# EAGLE design LME49600_HPA (EAGLE 7.2.0)
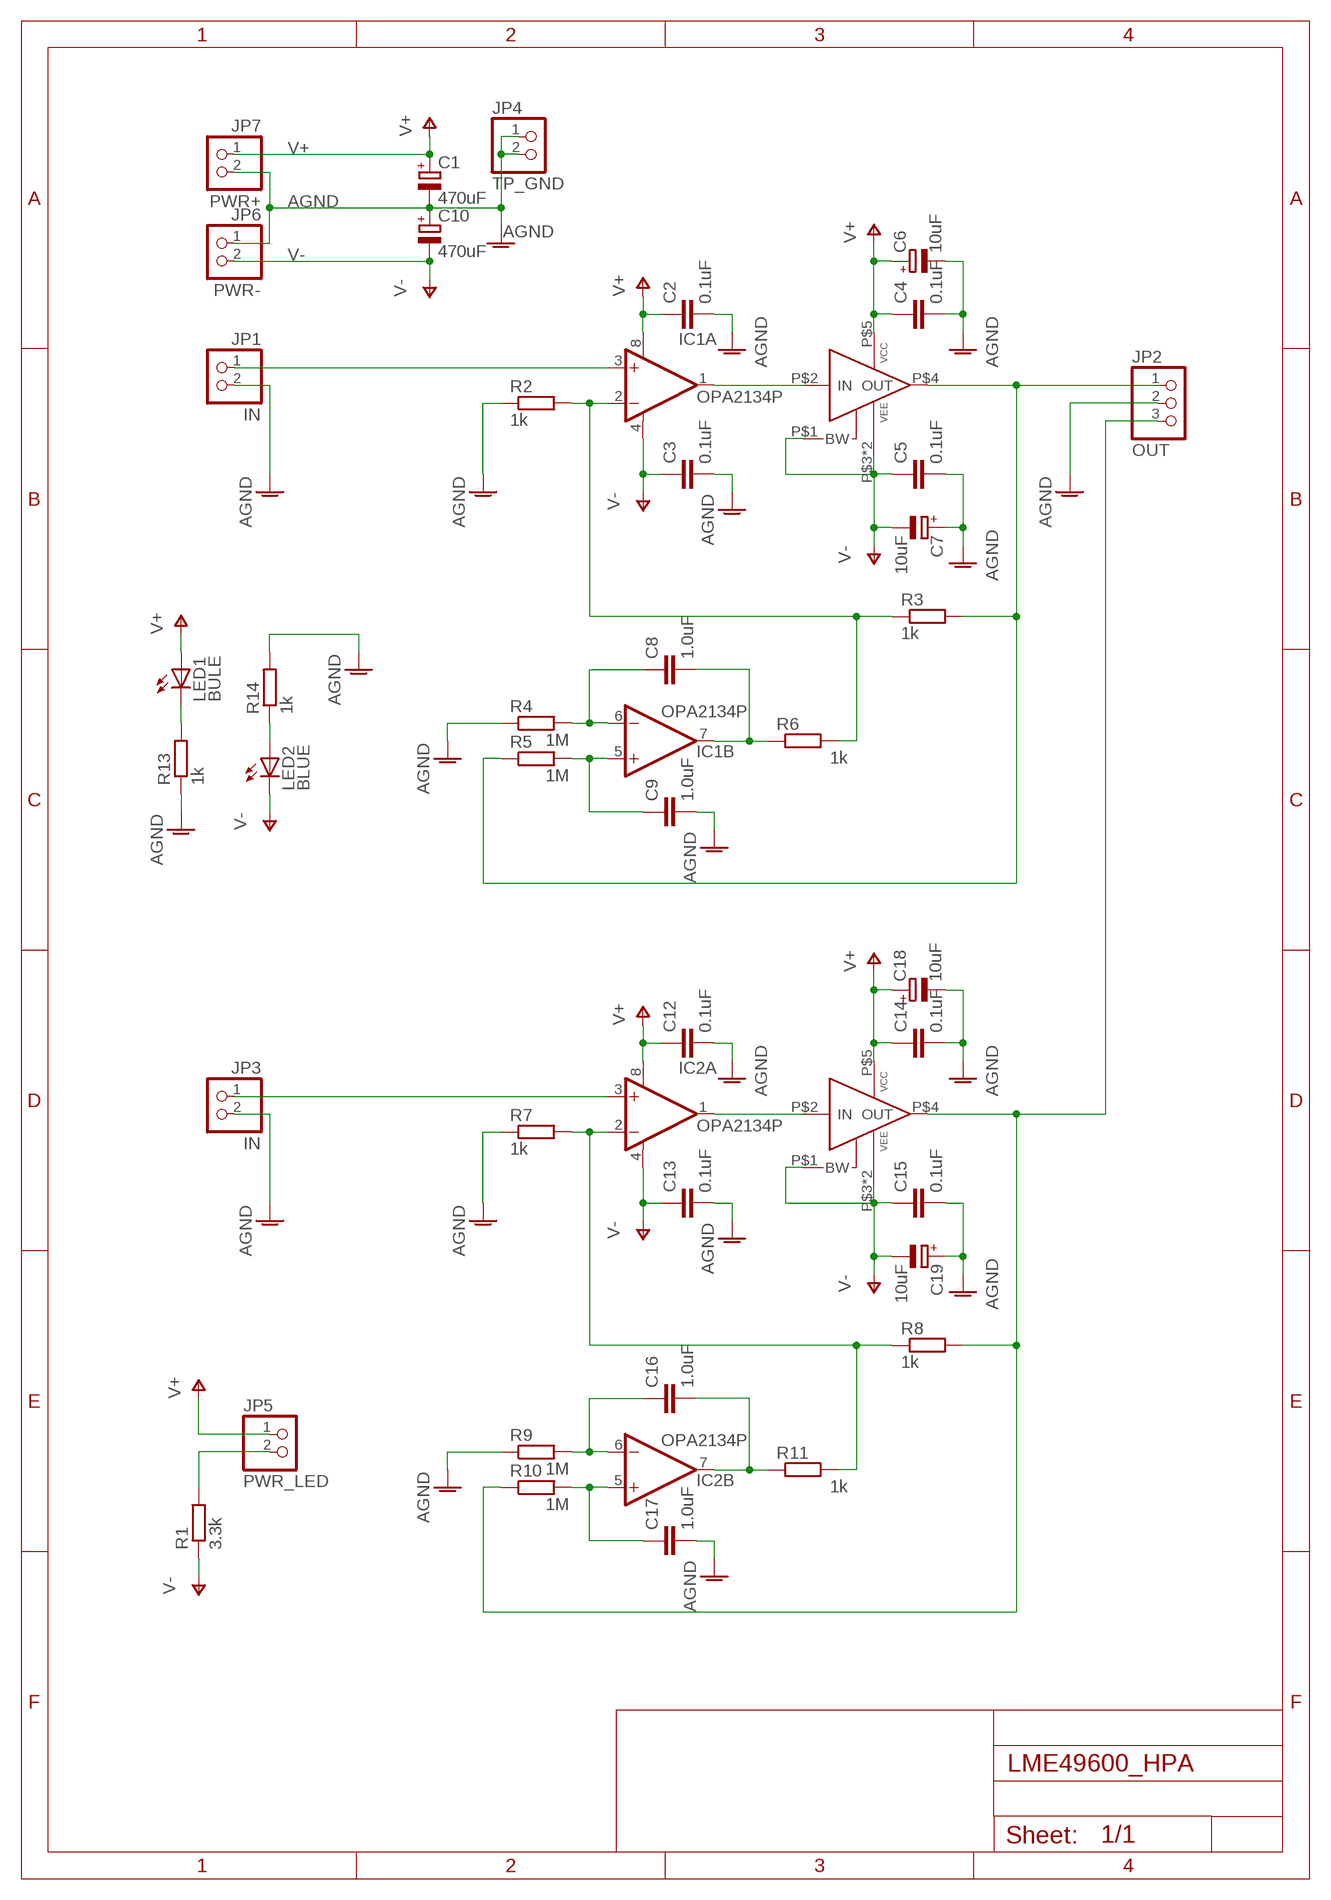
[diagram p0: schematic, sheet 1]

## Parts
C1  470uF  CPOL-EUE7.5-16  [E7,5-16]
C2  0.1uF  C-EU025-024X044  [C025-024X044]
C3  0.1uF  C-EU025-024X044  [C025-024X044]
C4  0.1uF  C-EU025-024X044  [C025-024X044]
C5  0.1uF  C-EU025-024X044  [C025-024X044]
C6  10uF  CPOL-EUE2.5-5  [E2,5-5]
C7  10uF  CPOL-EUE2.5-5  [E2,5-5]
C8  1.0uF  C-EU050-050X075  [C050-050X075]
C9  1.0uF  C-EU050-050X075  [C050-050X075]
C10  470uF  CPOL-EUE7.5-16  [E7,5-16]
C12  0.1uF  C-EU025-024X044  [C025-024X044]
C13  0.1uF  C-EU025-024X044  [C025-024X044]
C14  0.1uF  C-EU025-024X044  [C025-024X044]
C15  0.1uF  C-EU025-024X044  [C025-024X044]
C16  1.0uF  C-EU050-050X075  [C050-050X075]
C17  1.0uF  C-EU050-050X075  [C050-050X075]
C18  10uF  CPOL-EUE2.5-5  [E2,5-5]
C19  10uF  CPOL-EUE2.5-5  [E2,5-5]
IC1  OPA2134P  [DIL08]
IC2  OPA2134P  [DIL08]
JP1  IN  PINHD-1X2  [1X02]
JP2  OUT  PINHD-1X3  [1X03]
JP3  IN  PINHD-1X2  [1X02]
JP4  TP_GND  PINHD-1X2  [1X02]
JP5  PWR_LED  PINHD-1X2  [1X02]
JP6  PWR-  PINHD-1X2  [1X02]
JP7  PWR+  PINHD-1X2  [1X02]
LED1  BULE  LED3MM  [LED3MM]
LED2  BLUE  LED3MM  [LED3MM]
R1  3.3k  R-EU_0207/7  [0207/7]
R2  1k  R-EU_0207/7  [0207/7]
R3  1k  R-EU_0207/7  [0207/7]
R4  1M  R-EU_0207/7  [0207/7]
R5  1M  R-EU_0207/7  [0207/7]
R6  1k  R-EU_0207/7  [0207/7]
R7  1k  R-EU_0207/7  [0207/7]
R8  1k  R-EU_0207/7  [0207/7]
R9  1M  R-EU_0207/7  [0207/7]
R10  1M  R-EU_0207/7  [0207/7]
R11  1k  R-EU_0207/7  [0207/7]
R13  1k  R-EU_0207/7  [0207/7]
R14  1k  R-EU_0207/7  [0207/7]
U$1  LME49600-BRD3  [TO-263-5L]
U$2  LME49600-BRD3  [TO-263-5L]

## Nets
AGND: C1.- C2.2 C3.2 C4.2 C5.2 C6.- C7.+ C9.2 C10.+ C12.2 C13.2 C14.2 C15.2 C17.2 C18.- C19.+ JP1.2 JP2.2 JP3.2 JP4.1 JP4.2 JP6.1 JP7.2 R2.1 R4.1 R7.1 R9.1 R13.1 R14.2
N$1: IC1.3(A:+IN) JP1.1
N$2: LED2.A R14.1
N$3: IC1.2(A:-IN) R2.2 R3.1 R6.2
N$4: IC2.2(A:-IN) R7.2 R8.1 R11.2
N$5: IC2.1(A:OUT) U$2.P$2(IN)
N$6: C8.1 IC1.6(B:-IN) R4.2
N$7: IC1.1(A:OUT) U$1.P$2(IN)
N$8: C9.1 IC1.5(B:+IN) R5.2
N$9: C16.1 IC2.6(B:-IN) R9.2
N$10: C17.1 IC2.5(B:+IN) R10.2
N$11: C8.2 IC1.7(B:OUT) R6.1
N$12: C16.2 IC2.7(B:OUT) R11.1
N$13: JP2.3 R8.2 R10.1 U$2.P$4(OUT)
N$14: JP2.1 R3.2 R5.1 U$1.P$4(OUT)
N$15: IC2.3(A:+IN) JP3.1
N$16: JP5.2 R1.2
N$17: LED1.K(C) R13.2
V+: C1.+ C2.1 C4.1 C6.+ C12.1 C14.1 C18.+ IC1.8(A:V+) IC2.8(A:V+) JP5.1 JP7.1 LED1.A U$1.P$5(VCC) U$2.P$5(VCC)
V-: C3.1 C5.1 C7.- C10.- C13.1 C15.1 C19.- IC1.4(A:V-) IC2.4(A:V-) JP6.2 LED2.K(C) R1.1 U$1.P$1(BW) U$1.P$3(VEE) U$1.P$6(VEE) U$2.P$1(BW) U$2.P$3(VEE) U$2.P$6(VEE)

## Library data of the parts
C1 C6 C7 C10 C18 C19 = rcl:CPOL-EU: POLARIZED CAPACITOR, European symbol
C2-C5 C8 C9 C12-C17 = rcl:C-EU: CAPACITOR, European symbol
IC1 IC2 = burr-brown:OPA2134: Operational Amplifier; MF: TEXAS INSTRUMENTS; MPN: OPA2134PA; OC_FARNELL: 1097574; OC_NEWARK: 74K3897
JP1 JP3-JP7 = pinhead:PINHD-1X2: PIN HEADER
JP2 = pinhead:PINHD-1X3: PIN HEADER
LED1 LED2 = led:LED: LED OSRAM: - CHIPLED LG R971, LG N971, LY N971, LG Q971, LY Q971, LO R971, LY R971 LH N974, LH R974 LS Q976, LO Q976, LY Q976 LO Q996 - Hyper CHIPLED LW Q18S LB Q993, LB Q99A, LB R99A - SideLED LS A670, LO A670, LY A670, LG A670, LP A670 LB A673, LV A673, LT A673, LW A673 LH A674 LY A675 LS A676, LA A676, LO A676, LY A676, LW A676 LS A679, LY A679, LG A679 - Hyper Micro SIDELED® LS Y876, LA Y876, LO Y876, LY Y876 LT Y87S - SmartLED LW L88C, LW L88S LB L89C, LB L89S, LG L890 LS L89K, LO L89K, LY L89K LS L896, LA L896, LO L896, LY L896 - TOPLED LS T670, LO T670, LY T670, LG T670, LP T670 LSG T670, LSP T670, LSY T670, LOP T670, LYG T670 LG T671, LOG T671, LSG T671 LB T673, LV T673, LT T673, LW T673 LH T674 LS T676, LA T676, LO T676, LY T676, LB T676, LH T676, LSB T676, LW T676 LB T67C, LV T67C, LT T67C, LS T67K, LO T67K, LY T67K, LW E67C LS E67B, LA E67B, LO E67B, LY E67B, LB E67C, LV E67C, LT E67C LW T67C LS T679, LY T679, LG T679 LS T770, LO T770, LY T770, LG T770, LP T770 LB T773, LV T773, LT T773, LW T773 LH T774 LS E675, LA E675, LY E675, LS T675 LS T776, LA T776, LO T776, LY T776, LB T776 LHGB T686 LT T68C, LB T68C - Hyper Mini TOPLED® LB M676 - Mini TOPLED Santana® LG M470 LS M47K, LO M47K, LY M47K Source: http://www.osram.convergy.de LUXEON: - LUMILED® LXK2-PW12-R00, LXK2-PW12-S00, LXK2-PW14-U00, LXK2-PW14-V00 LXK2-PM12-R00, LXK2-PM12-S00, LXK2-PM14-U00 LXK2-PE12-Q00, LXK2-PE12-R00, LXK2-PE12-S00, LXK2-PE14-T00, LXK2-PE14-U00 LXK2-PB12-K00, LXK2-PB12-L00, LXK2-PB12-M00, LXK2-PB14-N00, LXK2-PB14-P00, LXK2-PB14-Q00 LXK2-PR12-L00, LXK2-PR12-M00, LXK2-PR14-Q00, LXK2-PR14-R00 LXK2-PD12-Q00, LXK2-PD12-R00, LXK2-PD12-S00 LXK2-PH12-R00, LXK2-PH12-S00 LXK2-PL12-P00, LXK2-PL12-Q00, LXK2-PL12-R00 Source: www.luxeon.com KINGBRIGHT: KA-3528ASYC Source: www.kingbright.com
R1-R11 R13 R14 = rcl:R-EU_: RESISTOR, European symbol
U$1 U$2 = mylib2:LME49600-BRD3

## Board
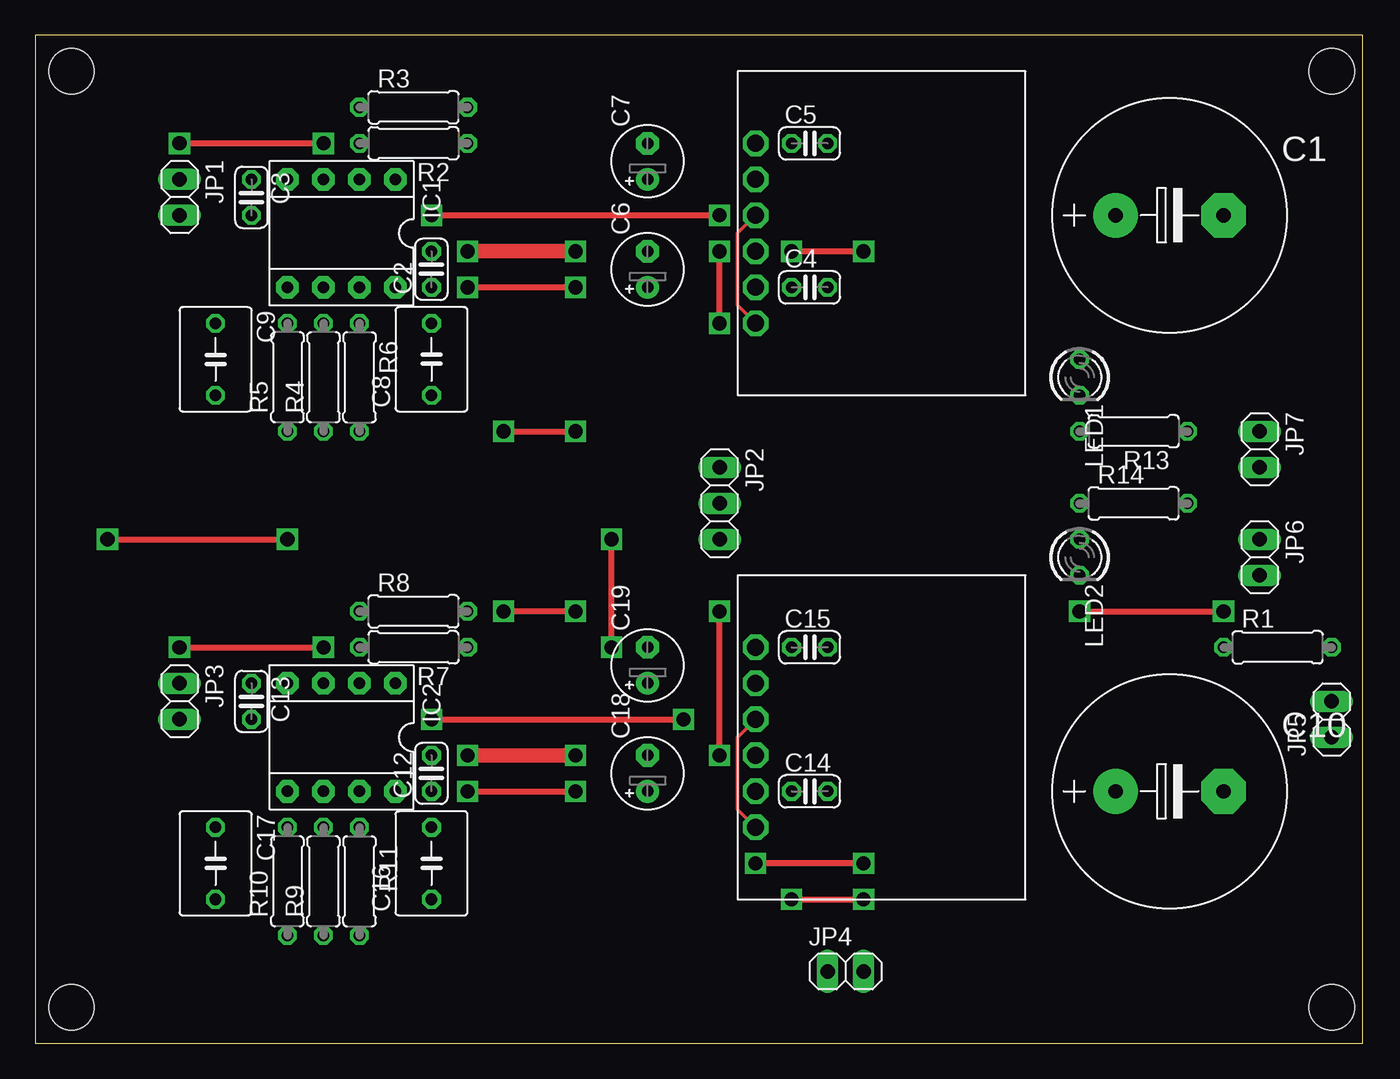
[diagram p1: board, top side]
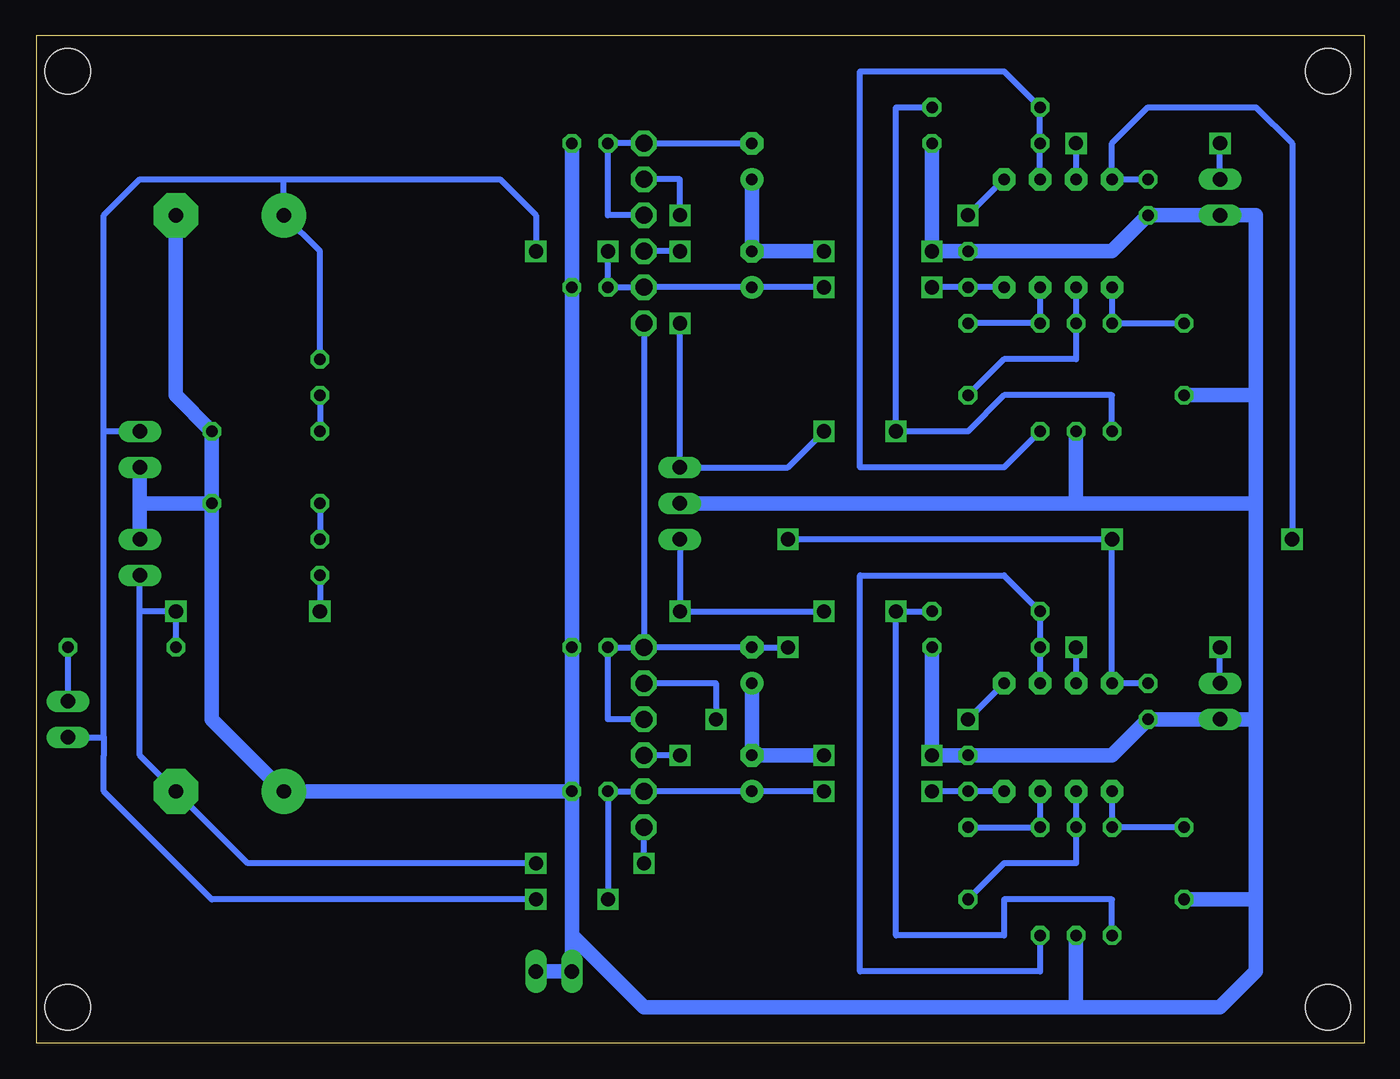
[diagram p2: board, bottom side, seen from below]

Size 93.65 x 71.11 mm. Coordinates in mm from the lower left corner, seen from the top.
Outline: 0,0 93.65,0 93.65,71.11 0,71.11 0,0
Copper layers (1*16): Top 0.035mm / dielectric 1.5mm / Bottom 0.035mm
Design rules "default": minimum track width 10mil, minimum drill 24mil, track to track 8mil, track to pad 8mil, pad to pad 8mil, via to via 8mil, smd to smd 8mil, copper to edge 40mil, drill to drill 8mil, minimum pad ring 10mil, minimum via ring 8mil, stop-mask expansion 4mil, vias tented up to drill 0mil, thermal gap 10mil
Holes 3.2 mm at 2.54,68.58 2.54,2.54 91.44,2.54 91.44,68.58

### Footprints (pad centres in the part's own frame; a part is rotated, then mirrored left to right if it is on the bottom)
E7,5-16 = drill 1.016 pad 3.15: + -3.81,0 | drill 1.016 pad 3.15 octagon: - 3.81,0
C025-024X044 = drill 0.813 octagon: 1 -1.27,0; 2 1.27,0
E2,5-5 = drill 0.813 pad 1.6: + -1.27,0 | drill 0.813 pad 1.6 octagon: - 1.27,0
C050-050X075 = drill 0.813 octagon: 1 -2.54,0; 2 2.54,0
DIL08 = drill 0.813 pad 1.6 octagon: 1 -3.81,-3.81; 2 -1.27,-3.81; 3 1.27,-3.81; 4 3.81,-3.81; 5 3.81,3.81; 6 1.27,3.81; 7 -1.27,3.81; 8 -3.81,3.81
1X02 = drill 1.016 long: 1 -1.27,0; 2 1.27,0
1X03 = drill 1.016 long: 1 -2.54,0; 2 0,0; 3 2.54,0
LED3MM = drill 0.813 octagon: A -1.27,0; K 1.27,0
0207/7 = drill 0.813 octagon: 1 -3.81,0; 2 3.81,0
TO-263-5L = drill 1.2 octagon: P$1 -6.35,-8.89; P$2 -3.81,-8.89; P$3 -1.27,-8.89; P$4 1.27,-8.89; P$5 3.81,-8.89; P$6 6.35,-8.89

### Placement (x,y rotation side)
C1  80.01,58.42 0 top
C2  27.94,54.61 90 top
C3  15.24,59.69 270 top
C4  54.61,53.34 0 top
C5  54.61,63.5 0 top
C6  43.18,54.61 90 top
C7  43.18,62.23 90 top
C8  27.94,48.26 90 top
C9  12.7,48.26 270 top
C10  80.01,17.78 0 top
C12  27.94,19.05 90 top
C13  15.24,24.13 270 top
C14  54.61,17.78 0 top
C15  54.61,27.94 0 top
C16  27.94,12.7 90 top
C17  12.7,12.7 270 top
C18  43.18,19.05 90 top
C19  43.18,26.67 90 top
IC1  21.59,57.15 180 top
IC2  21.59,21.59 180 top
JP1  10.16,59.69 270 top
JP2  48.26,38.1 270 top
JP3  10.16,24.13 270 top
JP4  57.15,5.08 0 top
JP5  91.44,22.86 90 top
JP6  86.36,34.29 270 top
JP7  86.36,41.91 270 top
LED1  73.66,46.99 270 top
LED2  73.66,34.29 270 top
R1  87.63,27.94 0 top
R2  26.67,63.5 180 top
R3  26.67,66.04 0 top
R4  20.32,46.99 90 top
R5  17.78,46.99 90 top
R6  22.86,46.99 270 top
R7  26.67,27.94 180 top
R8  26.67,30.48 0 top
R9  20.32,11.43 90 top
R10  17.78,11.43 90 top
R11  22.86,11.43 270 top
R13  77.47,43.18 180 top
R14  77.47,38.1 0 top
U$1  59.69,57.15 270 top
U$2  59.69,21.59 270 top

### Tracks (layer width: path | path; a pad name or v marks a point on that pad's centre or on a via)
AGND  (via drill 1)
  Top 1.016: v38.1,55.88 v30.48,55.88 | v38.1,20.32 v30.48,20.32
  Bottom 0.406: C9.2 10.16,45.72
  Bottom 1.016: C7.+ C6.- v38.1,55.88 | R2.1 v30.48,55.88 C2.2 17.78,55.88 C3.2 JP1.2 7.62,58.42 7.62,45.72 | C19.+ C18.- v38.1,20.32 | R7.1 v30.48,20.32 C12.2 17.78,20.32 C13.2 JP3.2 7.62,22.86 | 7.62,45.72 7.62,38.1 | C9.2 7.62,45.72 | JP2.2 20.32,38.1 | 20.32,38.1 7.62,38.1 | C14.2 C15.2 C4.2 C5.2 | 7.62,38.1 7.62,22.86 | 7.62,22.86 7.62,10.16 | C17.2 7.62,10.16 | R9.1 20.32,2.54 | C14.2 C10.+ 81.28,22.86 R14.2 | 7.62,10.16 7.62,5.08 10.16,2.54 20.32,2.54 | R4.1 20.32,38.1 | 20.32,2.54 50.8,2.54 55.88,7.62 | 55.88,7.62 C14.2 | R14.2 R13.1 83.82,45.72 C1.- | JP7.2 86.36,38.1 | 86.36,38.1 JP6.1 | R14.2 86.36,38.1 | 55.88,7.62 JP4.1 JP4.2
N$1  (via drill 1)
  Top 0.406: v10.16,63.5 v20.32,63.5
  Bottom 0.406: JP1.1 v10.16,63.5 | v20.32,63.5 IC1.3
N$2
  Bottom 0.406: R14.1 LED2.A
N$3
  Bottom 0.406: IC1.2 R2.2 R3.1 25.4,68.58 35.56,68.58 35.56,40.64 25.4,40.64 R6.2
N$4
  Bottom 0.406: IC2.2 R7.2 R8.1 25.4,33.02 35.56,33.02 35.56,5.08 22.86,5.08 R11.2
N$5  (via drill 1)
  Top 0.406: v27.94,22.86 v45.72,22.86
  Bottom 0.406: U$2.P$2 45.72,25.4 v45.72,22.86 | IC2.1 v27.94,22.86
N$6
  Bottom 0.406: IC1.6 R4.2 20.32,48.26 25.4,48.26 C8.1
N$7  (via drill 1)
  Top 0.406: v27.94,58.42 v48.26,58.42
  Bottom 0.406: v48.26,58.42 48.26,60.96 U$1.P$2 | IC1.1 v27.94,58.42
N$8
  Bottom 0.406: IC1.5 R5.2 C9.1
N$9
  Bottom 0.406: IC2.6 R9.2 20.32,12.7 25.4,12.7 C16.1
N$10
  Bottom 0.406: IC2.5 R10.2 C17.1
N$11
  Bottom 0.406: IC1.7 R6.1 C8.2
N$12
  Bottom 0.406: IC2.7 R11.1 C16.2
N$13  (via drill 1)
  Top 0.406: v38.1,30.48 v33.02,30.48 | v48.26,20.32 v48.26,30.48
  Bottom 0.406: R10.1 17.78,10.16 25.4,10.16 25.4,7.62 33.02,7.62 v33.02,30.48 R8.2 | v38.1,30.48 v48.26,30.48 JP2.3 | v48.26,20.32 U$2.P$4
N$14  (via drill 1)
  Top 0.406: v48.26,50.8 v48.26,55.88 | v33.02,43.18 v38.1,43.18
  Bottom 0.406: R5.1 17.78,45.72 25.4,45.72 27.94,43.18 v33.02,43.18 33.02,66.04 R3.2 | v48.26,55.88 U$1.P$4 | v48.26,50.8 JP2.1 40.64,40.64 v38.1,43.18
N$15  (via drill 1)
  Top 0.406: v10.16,27.94 v20.32,27.94
  Bottom 0.406: JP3.1 v10.16,27.94 | v20.32,27.94 IC2.3
N$16
  Bottom 0.406: R1.2 JP5.2
N$17
  Bottom 0.406: LED1.K R13.2
V+  (via drill 1)
  Top 0.406: v30.48,53.34 v38.1,53.34 | v30.48,17.78 v38.1,17.78 | v53.34,55.88 v58.42,55.88 | v53.34,10.16 v58.42,10.16
  Bottom 0.406: IC1.8 C2.1 v30.48,53.34 | v38.1,53.34 C6.+ U$1.P$5 C4.1 v53.34,55.88 | IC2.8 C12.1 v30.48,17.78 | v38.1,17.78 C18.+ U$2.P$5 C14.1 v53.34,10.16 | v58.42,10.16 81.28,10.16 88.9,17.78 88.9,20.32 88.9,21.59 | 88.9,21.59 88.9,43.18 | 88.9,43.18 88.9,58.42 86.36,60.96 76.2,60.96 | JP7.1 88.9,43.18 | 76.2,60.96 60.96,60.96 58.42,58.42 v58.42,55.88 | 76.2,60.96 C1.+ 73.66,55.88 LED1.A | JP5.1 88.9,21.59
V-  (via drill 1)
  Top 0.254: U$1.P$3 49.53,57.15 49.53,52.07 U$1.P$6 | U$2.P$6 49.53,16.51 49.53,21.59 U$2.P$3
  Top 0.406: v40.64,27.94 v40.64,35.56 | v58.42,12.7 v50.8,12.7 | v5.08,35.56 v17.78,35.56 | v73.66,30.48 v83.82,30.48
  Bottom 0.406: C3.1 IC1.4 17.78,63.5 15.24,66.04 7.62,66.04 5.08,63.5 v5.08,35.56 | U$1.P$3 53.34,58.42 C5.1 U$1.P$1 C7.- | C13.1 IC2.4 v17.78,35.56 v40.64,35.56 | U$2.P$1 C19.- v40.64,27.94 | U$2.P$1 C15.1 53.34,22.86 U$2.P$3 | U$1.P$6 U$2.P$1 | v50.8,12.7 U$2.P$6 | v58.42,12.7 78.74,12.7 C10.- 86.36,20.32 86.36,30.48 | LED2.K v73.66,30.48 | 86.36,30.48 JP6.2 | 86.36,30.48 v83.82,30.48 R1.1

### Text on the board
Document: Not Connect